# EAGLE design motor-driver-VNH23P30 (EAGLE 6.2)
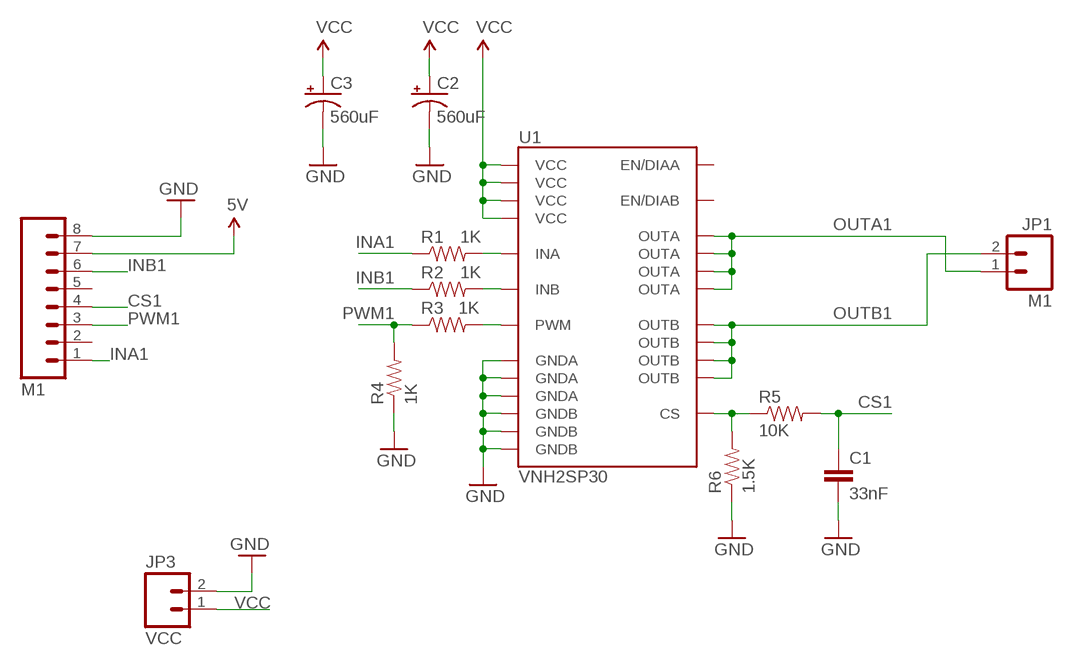
[diagram p0: schematic, sheet 1]

## Parts
C1  33nF  CAP1206  [1206]
C2  560uF  CAP_POLG  [PANASONIC_G]
C3  560uF  CAP_POLG  [PANASONIC_G]
JP1  M1  M02PTH4  [1X02_XTRA_BIG]
JP3  VCC  M02PTH4  [1X02_XTRA_BIG]
P  M1  M081X08  [1X08]
R1  1K  RESISTOR1206  [1206]
R2  1K  RESISTOR1206  [1206]
R3  1K  RESISTOR1206  [1206]
R4  1K  RESISTOR1206  [1206]
R5  10K  RESISTOR1206  [1206]
R6  1.5K  RESISTOR1206  [1206]
U1  VNH2SP30  [VNH2SP30]

## Nets
5V: P.7
CS1: C1.1 P.4 R5.2
GND: C1.2 C2.- C3.- JP3.2 P.8 R4.1 R6.1 U1.18(GNDB) U1.19(GNDB) U1.20(GNDB) U1.26(GNDA) U1.27(GNDA) U1.28(GNDA)
INA1: P.1 R1.1
INB1: P.6 R2.1
N$1: R2.2 U1.11(INB)
N$2: R1.2 U1.5(INA)
N$5: R3.2 U1.8(PWM)
N$7: R5.1 R6.2 U1.9(CS)
OUTA1: JP1.1 U1.1(OUTA) U1.25(OUTA) U1.30(OUTA) U1.SLUG3(OUTA)
OUTB1: JP1.2 U1.15(OUTB) U1.16(OUTB) U1.21(OUTB) U1.SLUG2(OUTB)
PWM1: P.3 R3.1 R4.2
VCC: C2.+ C3.+ JP3.1 U1.3(VCC) U1.13(VCC) U1.23(VCC) U1.SLUG1(VCC)
Unconnected: P.2 P.5 U1.6(EN/DIAA) U1.10(EN/DIAB)

## Library data of the parts
C1 = SparkFun-Passives:CAP: Capacitor Standard 0603 ceramic capacitor, and 0.1" leaded capacitor.
C2 C3 = SparkFun:CAP_POL: Capacitor Polarized These are standard SMD and PTH capacitors. Normally 10uF, 47uF, and 100uF in electrolytic and tantalum varieties. Always verify the external diameter of the through hole cap, it varies with capacity, voltage, and manufacturer. The EIA devices should be standard.
JP1 JP3 = SparkFun:M02: Header 2 Standard 2-pin 0.1" header. Use with straight break away headers (SKU : PRT-00116), right angle break away headers (PRT-00553), swiss pins (PRT-00743), machine pins (PRT-00117), and female headers (PRT-00115). Molex polarized connector foot print use with SKU : PRT-08233 with associated crimp pins and housings.
P = SparkFun:M08: Header 8 Standard 8-pin 0.1" header. Use with straight break away headers (SKU : PRT-00116), right angle break away headers (PRT-00553), swiss pins (PRT-00743), machine pins (PRT-00117), and female headers (PRT-00115).
R1-R6 = SparkFun-Passives:RESISTOR: Resistor Basic schematic elements and footprints for 0603, 1206, and PTH resistors.
U1 = SparkFun:VNH2SP30

## Board
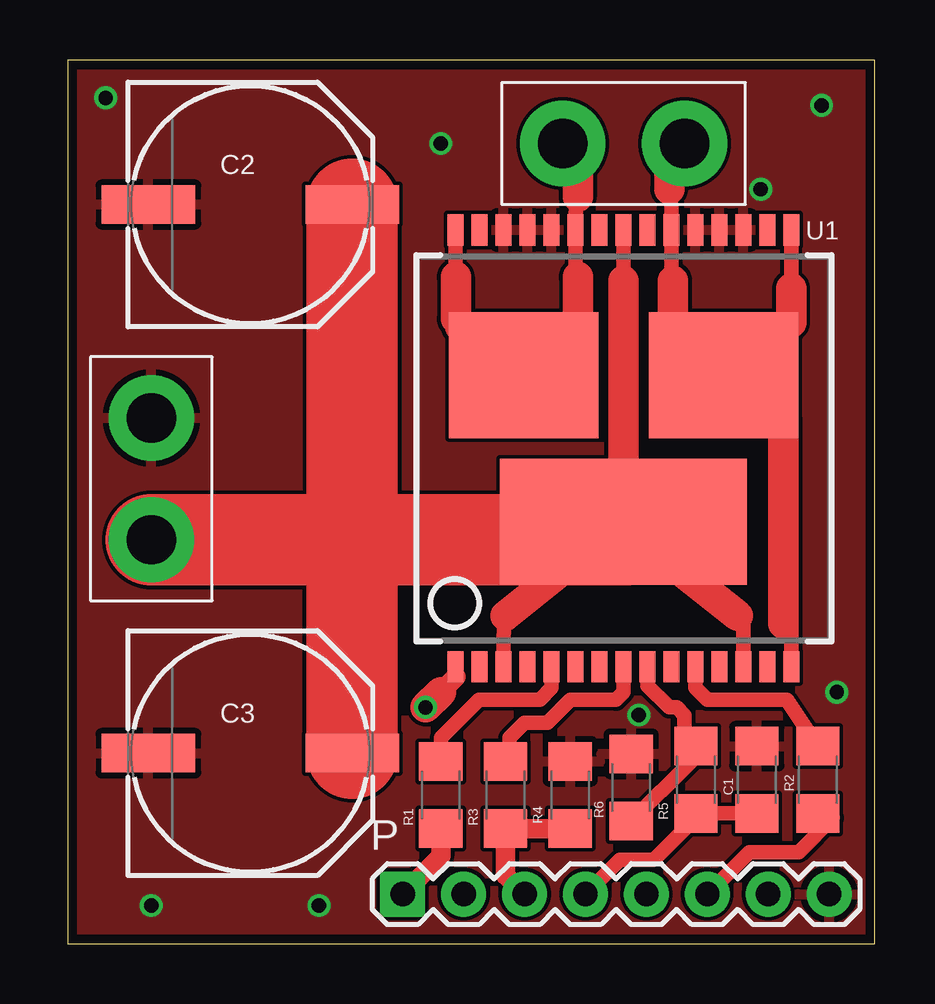
[diagram p1: board, top side]
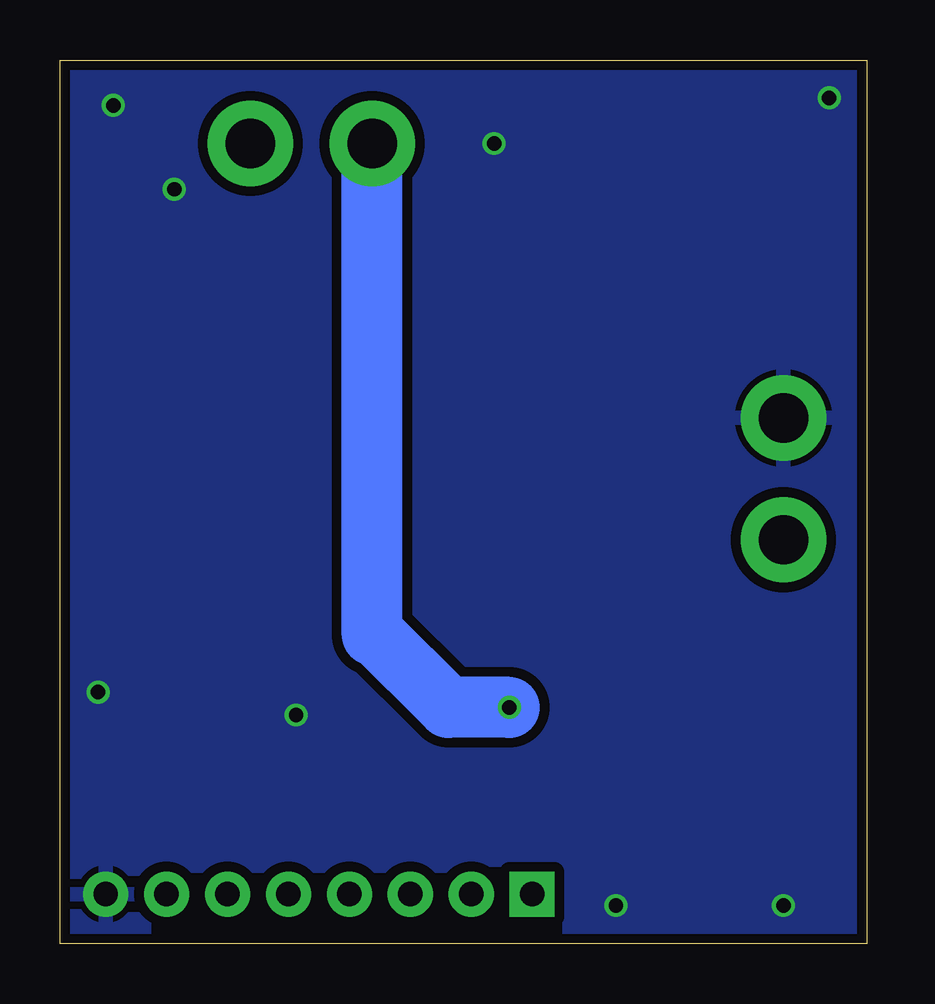
[diagram p2: board, bottom side, seen from below]

Size 33.65 x 36.82 mm. Coordinates in mm from the lower left corner, seen from the top.
Outline: 33.65,0 33.65,36.82 0,36.82 0,0 33.65,0
Copper layers (1*16): Top 0.0356mm / dielectric 1.5011mm / Bottom 0.0356mm
Design rules "default": minimum track width 6mil, minimum drill 13mil, track to track 6mil, track to pad 6mil, pad to pad 6mil, via to via 6mil, smd to smd 6mil, copper to edge 15mil, drill to drill 6mil, minimum pad ring 7mil, minimum via ring 7mil, stop-mask expansion 4mil, vias tented up to drill 0mil, thermal gap 10mil

### Footprints (pad centres in the part's own frame; a part is rotated, then mirrored left to right if it is on the bottom)
1206 = smd 1.6 x 1.8: 1 -1.4,0; 2 1.4,0
PANASONIC_G = smd 3.9 x 1.6: + 4.25,0; - -4.25,0
1X02_XTRA_BIG = drill 2.057 pad 3.556: 1 -2.54,0; 2 2.54,0
1X08 = drill 1.016 pad 1.88 square: 1 0,0 | drill 1.016 pad 1.88: 2 2.54,0; 3 5.08,0; 4 7.62,0; 5 10.16,0; 6 12.7,0; 7 15.24,0; 8 17.78,0
VNH2SP30 = smd 0.67 x 1.3: 1 -7,-9.1; 2 -6,-9.1; 3 -5,-9.1; 4 -4,-9.1; 5 -3,-9.1; 6 -2,-9.1; 7 -1,-9.1; 8 0,-9.1; 9 1,-9.1; 10 2,-9.1; 11 3,-9.1; 12 4,-9.1; 13 5,-9.1; 14 6,-9.1; 15 7,-9.1; 16 7,9.1; 17 6,9.1; 18 5,9.1; 19 4,9.1; 20 3,9.1; 21 2,9.1; 22 1,9.1; 23 0,9.1; 24 -1,9.1; 25 -2,9.1; 26 -3,9.1; 27 -4,9.1; 28 -5,9.1; 29 -6,9.1; 30 -7,9.1 | smd 10.3 x 5.25: SLUG1 0,-3.05 | smd 6.23 x 5.25: SLUG2 4.165,3.05; SLUG3 -4.165,3.05

### Placement (x,y rotation side)
C1  28.72,6.83 90 top
C2  7.61,30.8 0 top
C3  7.61,7.94 0 top
JP1  23.17,33.34 0 top
JP3  3.48,19.37 90 top
P  13.96,2.06 0 top
R1  15.55,6.19 90 top
R2  31.26,6.83 90 top
R3  18.25,6.19 90 top
R4  20.95,6.19 270 top
R5  26.18,6.83 270 top
R6  23.48,6.51 270 top
U1  23.17,20.64 0 top

### Tracks (layer width: path | path; a pad name or v marks a point on that pad's centre or on a via)
CS1
  Top 0.61: C1.1 R5.2 26.18,5.24 24.44,3.49 23.01,3.49 P.4
GND  (via drill 0.6)
  other vias: 31.42,34.92 28.88,31.43 1.58,35.24 15.55,33.34 3.48,1.59 32.06,10.48 10.47,1.59 23.8,9.52
  pour Bottom (isolate 0.406): 0.31,36.51 0.31,0.32 33.33,0.32 33.33,36.51
  pour Top: 33.49,36.67 0.15,36.67 0.15,0.16 33.49,0.16
INA1
  Top 0.813: R1.1 15.55,3.65 P.1
INB1
  Top 0.61: R2.1 31.9,5.24 30.47,3.81 28.41,3.81 P.6
N$1
  Top 0.61: U1.11 26.17,10.65 26.66,10.16 29.97,10.16 R2.2
N$2
  Top 0.61: U1.5 20.17,10.65 19.67,10.16 17.14,10.16 15.55,8.57 R1.2
N$5
  Top 0.61: U1.8 23.17,10.48 22.85,10.16 20.94,10.16 19.99,9.21 19.04,9.21 18.41,8.57 18.41,7.75 R3.2
N$7
  Top 0.61: U1.9 24.17,10.75 25.07,9.84 25.39,9.84 25.71,9.52 25.71,8.39 R5.1 26.18,7.78 24.76,6.35 24.73,6.35 R6.2
OUTA1  (via drill 0.6)
  Top 0.406: U1.1 16.18,11.11
  Top 0.61: 21.17,25.22 U1.SLUG3 | U1.30 16.17,27.8 16.18,27.78 | 21.26,27.78 21.17,27.88 U1.25 21.17,30.38 21.26,31.12 | U1.1
  Top 0.813: 16.18,11.11 15.55,10.48
  Top 1.27: JP1.1 21.26,32.7 21.26,31.12 | 16.18,27.78 16.18,26.03 16.34,25.88 16.34,25.71 U1.SLUG3 19.76,23.81 20.63,23.81 21.26,24.45 21.26,27.78 | 15.55,10.48 v14.91,9.84
  Bottom 2.54: 20.63,12.86 20.63,13.02 | 20.63,13.02 JP1.1 | v14.91,9.84 17.45,9.84 20.63,13.02
OUTB1
  Top 0.61: 25.07,31.43 25.17,30.7 U1.21 25.17,27.69 25.23,27.62 | 30.15,27.3 30.17,27.32 U1.16 | 29.84,13.34 30.17,13.64 U1.15
  Top 1.27: JP1.2 25.07,32.7 25.07,31.43 | 25.23,27.62 25.23,25.08 26.34,23.97 26.41,23.97 U1.SLUG2 | U1.SLUG2 30.15,25.87 30.15,27.3 | U1.SLUG2 29.84,21.82 29.84,13.34
PWM1
  Top 0.813: R4.2 R3.1 18.25,2.86 P.3
VCC
  Top 0.61: U1.3 18.17,12.78 18.25,13.65 | 28.17,11.83 U1.13 28.17,13.41 27.93,13.65 | 23.8,16.83 23.8,16.32 23.55,17.21 U1.SLUG1 | U1.23 23.17,27.62
  Top 1.27: 23.17,27.62 U1.SLUG1 22.34,16.95 18.25,13.65 | 23.8,16.83 24.76,16.19 27.93,13.65
  Top 3.81: 11.1,16.83 JP3.1 7.17,16.83 | 11.1,16.83 12.37,16.83 | 12.37,16.83 23.29,16.83 23.55,17.21 | C2.+ 11.86,17.59 11.1,16.83 | C3.+ 11.86,16.32 12.37,16.83